# EAGLE design Laser_Array_Temp_Low_BRD_V2.1 (EAGLE 7.7.0)
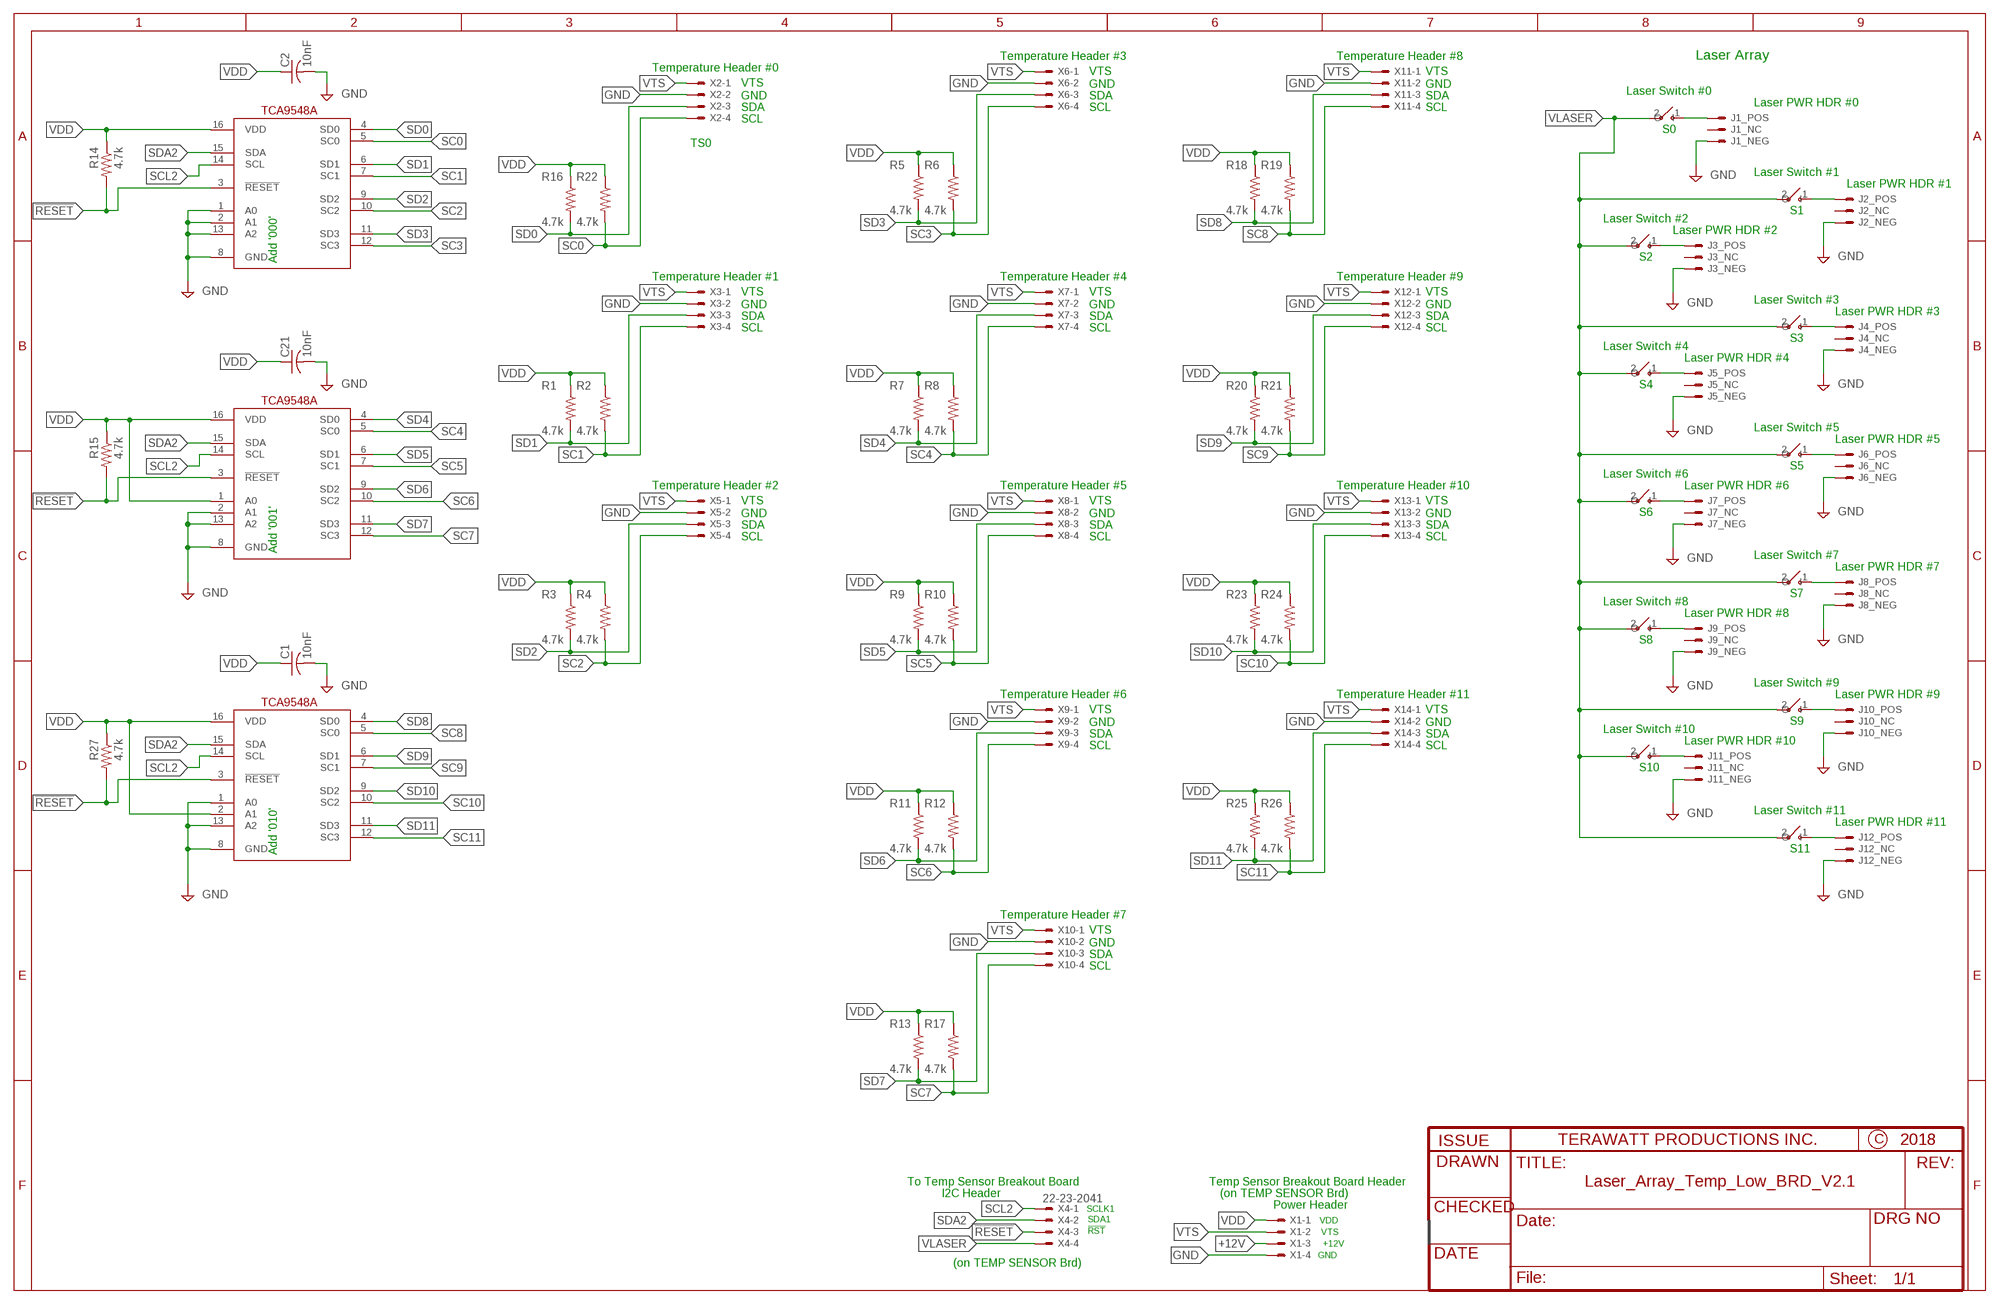
[diagram p0: schematic, sheet 1]

## Parts
C1  10nF  C-USC0805  [C0805]
C2  10nF  C-USC0805  [C0805]
C21  10nF  C-USC0805  [C0805]
J1  LASER_MOD  [LASER_MOD]
J2  LASER_MOD  [LASER_MOD]
J3  LASER_MOD  [LASER_MOD]
J4  LASER_MOD  [LASER_MOD]
J5  LASER_MOD  [LASER_MOD]
J6  LASER_MOD  [LASER_MOD]
J7  LASER_MOD  [LASER_MOD]
J8  LASER_MOD  [LASER_MOD]
J9  LASER_MOD  [LASER_MOD]
J10  LASER_MOD  [LASER_MOD]
J11  LASER_MOD  [LASER_MOD]
J12  LASER_MOD  [LASER_MOD]
R1  4.7k  R-US_M0805  [M0805]
R2  4.7k  R-US_M0805  [M0805]
R3  4.7k  R-US_M0805  [M0805]
R4  4.7k  R-US_M0805  [M0805]
R5  4.7k  R-US_M0805  [M0805]
R6  4.7k  R-US_M0805  [M0805]
R7  4.7k  R-US_M0805  [M0805]
R8  4.7k  R-US_M0805  [M0805]
R9  4.7k  R-US_M0805  [M0805]
R10  4.7k  R-US_M0805  [M0805]
R11  4.7k  R-US_M0805  [M0805]
R12  4.7k  R-US_M0805  [M0805]
R13  4.7k  R-US_M0805  [M0805]
R14  4.7k  R-US_M0805  [M0805]
R15  4.7k  R-US_M0805  [M0805]
R16  4.7k  R-US_M0805  [M0805]
R17  4.7k  R-US_M0805  [M0805]
R18  4.7k  R-US_M0805  [M0805]
R19  4.7k  R-US_M0805  [M0805]
R20  4.7k  R-US_M0805  [M0805]
R21  4.7k  R-US_M0805  [M0805]
R22  4.7k  R-US_M0805  [M0805]
R23  4.7k  R-US_M0805  [M0805]
R24  4.7k  R-US_M0805  [M0805]
R25  4.7k  R-US_M0805  [M0805]
R26  4.7k  R-US_M0805  [M0805]
R27  4.7k  R-US_M0805  [M0805]
S13  TOGGLE_SPST  [22-23-2021]
S14  TOGGLE_SPST  [22-23-2021]
S15  TOGGLE_SPST  [22-23-2021]
S16  TOGGLE_SPST  [22-23-2021]
S17  TOGGLE_SPST  [22-23-2021]
S18  TOGGLE_SPST  [22-23-2021]
S19  TOGGLE_SPST  [22-23-2021]
S20  TOGGLE_SPST  [22-23-2021]
S21  TOGGLE_SPST  [22-23-2021]
S22  TOGGLE_SPST  [22-23-2021]
S23  TOGGLE_SPST  [22-23-2021]
S24  TOGGLE_SPST  [22-23-2021]
U1  TCA9546A  [SOIC16N]
U2  TCA9546A  [SOIC16N]
U3  TCA9546A  [SOIC16N]
X1  22-23-2041  [22-23-2041]
X2  22-23-2041  [22-23-2041]
X3  22-23-2041  [22-23-2041]
X4  22-23-2041  [22-23-2041]
X5  22-23-2041  [22-23-2041]
X6  22-23-2041  [22-23-2041]
X7  22-23-2041  [22-23-2041]
X8  22-23-2041  [22-23-2041]
X9  22-23-2041  [22-23-2041]
X10  22-23-2041  [22-23-2041]
X11  22-23-2041  [22-23-2041]
X12  22-23-2041  [22-23-2041]
X13  22-23-2041  [22-23-2041]
X14  22-23-2041  [22-23-2041]

## Nets
!RESET: R14.2 R15.2 R27.2 U1.3(!RESET) U2.3(!RESET) U3.3(!RESET) X4.3
+12V: X1.3
GND: C1.2 C2.2 C21.2 J1.3 J2.3 J3.3 J4.3 J5.3 J6.3 J7.3 J8.3 J9.3 J10.3 J11.3 J12.3 U1.1(A0) U1.2(A1) U1.8(GND) U1.13(A2) U2.2(A1) U2.8(GND) U2.13(A2) U3.1(A0) U3.8(GND) U3.13(A2) X1.4 X2.2 X3.2 X5.2 X6.2 X7.2 X8.2 X9.2 X10.2 X11.2 X12.2 X13.2 X14.2
N$1: J2.1 S13.1(O)
N$2: J1.1 S16.1(O)
N$3: J3.1 S14.1(O)
N$4: J4.1 S15.1(O)
N$5: J5.1 S17.1(O)
N$6: J6.1 S18.1(O)
N$7: J7.1 S19.1(O)
N$8: J8.1 S20.1(O)
N$9: J9.1 S21.1(O)
N$10: J10.1 S22.1(O)
N$11: J11.1 S23.1(O)
N$12: J12.1 S24.1(O)
SC0: R22.2 U1.5(SC0) X2.4
SC1: R2.2 U1.7(SC1) X3.4
SC2: R4.2 U1.10(SC2) X5.4
SC3: R6.2 U1.12(SC3) X6.4
SC4: R8.2 U2.5(SC0) X7.4
SC5: R10.2 U2.7(SC1) X8.4
SC6: R12.2 U2.10(SC2) X9.4
SC7: R17.2 U2.12(SC3) X10.4
SC8: R19.2 U3.5(SC0) X11.4
SC9: R21.2 U3.7(SC1) X12.4
SC10: R24.2 U3.10(SC2) X13.4
SC11: R26.2 U3.12(SC3) X14.4
SCL2: U1.14(SCL) U2.14(SCL) U3.14(SCL) X4.1
SD0: R16.2 U1.4(SD0) X2.3
SD1: R1.2 U1.6(SD1) X3.3
SD2: R3.2 U1.9(SD2) X5.3
SD3: R5.2 U1.11(SD3) X6.3
SD4: R7.2 U2.4(SD0) X7.3
SD5: R9.2 U2.6(SD1) X8.3
SD6: R11.2 U2.9(SD2) X9.3
SD7: R13.2 U2.11(SD3) X10.3
SD8: R18.2 U3.4(SD0) X11.3
SD9: R20.2 U3.6(SD1) X12.3
SD10: R23.2 U3.9(SD2) X13.3
SD11: R25.2 U3.11(SD3) X14.3
SDA2: U1.15(SDA) U2.15(SDA) U3.15(SDA) X4.2
VDD: C1.1 C2.1 C21.1 R1.1 R2.1 R3.1 R4.1 R5.1 R6.1 R7.1 R8.1 R9.1 R10.1 R11.1 R12.1 R13.1 R14.1 R15.1 R16.1 R17.1 R18.1 R19.1 R20.1 R21.1 R22.1 R23.1 R24.1 R25.1 R26.1 R27.1 U1.16(VDD) U2.1(A0) U2.16(VDD) U3.2(A1) U3.16(VDD) X1.1
VLASER: S13.2(I) S14.2(I) S15.2(I) S16.2(I) S17.2(I) S18.2(I) S19.2(I) S20.2(I) S21.2(I) S22.2(I) S23.2(I) S24.2(I) X4.4
VTS: X1.2 X2.1 X3.1 X5.1 X6.1 X7.1 X8.1 X9.1 X10.1 X11.1 X12.1 X13.1 X14.1
Unconnected: J1.2 J2.2 J3.2 J4.2 J5.2 J6.2 J7.2 J8.2 J9.2 J10.2 J11.2 J12.2

## Notes on the sheet
- Temperature Header #3 | Temperature Header #8 | Laser Array
- Temperature Header #0
- VTS | VTS
- VTS | GND | GND
- Laser Switch #0
- GND | SDA | SDA
- Laser PWR HDR #0
- SDA | SCL | SCL
- SCL
- S0
- TS0
- Laser Switch #1
- Laser PWR HDR #1
- S1
- Laser Switch #2
- Laser PWR HDR #2
- Add '000' | S2
- Temperature Header #1 | Temperature Header #4 | Temperature Header #9
- VTS | VTS | VTS
- Laser Switch #3
- GND | GND | GND
- Laser PWR HDR #3
- SDA | SDA | SDA
- SCL | SCL | SCL
- S3
- Laser Switch #4
- Laser PWR HDR #4
- S4
- Laser Switch #5
- Laser PWR HDR #5
- S5
- Laser Switch #6
- Temperature Header #2 | Temperature Header #5 | Temperature Header #10 | Laser PWR HDR #6
- VTS | VTS | VTS
- GND | GND | GND | S6
- SDA | SDA | SDA
- SCL | SCL | SCL
- Add '001'
- Laser Switch #7
- Laser PWR HDR #7
- S7
- Laser Switch #8
- Laser PWR HDR #8
- S8
- Laser Switch #9
- Temperature Header #6 | Temperature Header #11 | Laser PWR HDR #9
- VTS | VTS
- GND | GND | S9
- Laser Switch #10
- SDA | SDA
- Laser PWR HDR #10
- SCL | SCL
- S10
- Laser Switch #11
- Laser PWR HDR #11
- Add '010' | S11
- Temperature Header #7
- VTS
- GND
- SDA
- SCL
- To Temp Sensor Breakout Board | Temp Sensor Breakout Board Header
- I2C Header | (on TEMP SENSOR Brd)
- Power Header
- SCLK1
- SDA1 | VDD
- !RST | VTS
- +12V
- GND
- (on TEMP SENSOR Brd)

## Library data of the parts
C1 C2 C21 = rcl:C-US: CAPACITOR, American symbol
J1-J12 = Mine:LASER_MOD
R1-R27 = rcl:R-US_: RESISTOR, American symbol
S13-S24 = Mine:TOGGLE_SPST: SPST Toggle SPST toggle switch with no package
U1-U3 = Mine:TCA9546A
X1-X14 = Mine:22-23-2041: .100" (2.54mm) Center Header - 4 Pin; MF: MOLEX; MPN: 22-23-2041; OC_FARNELL: 1462920; OC_NEWARK: 38C0355

## Net classes
0 default: width 0.254 mm, drill 0.508 mm, clearance 0.203 mm

## Board
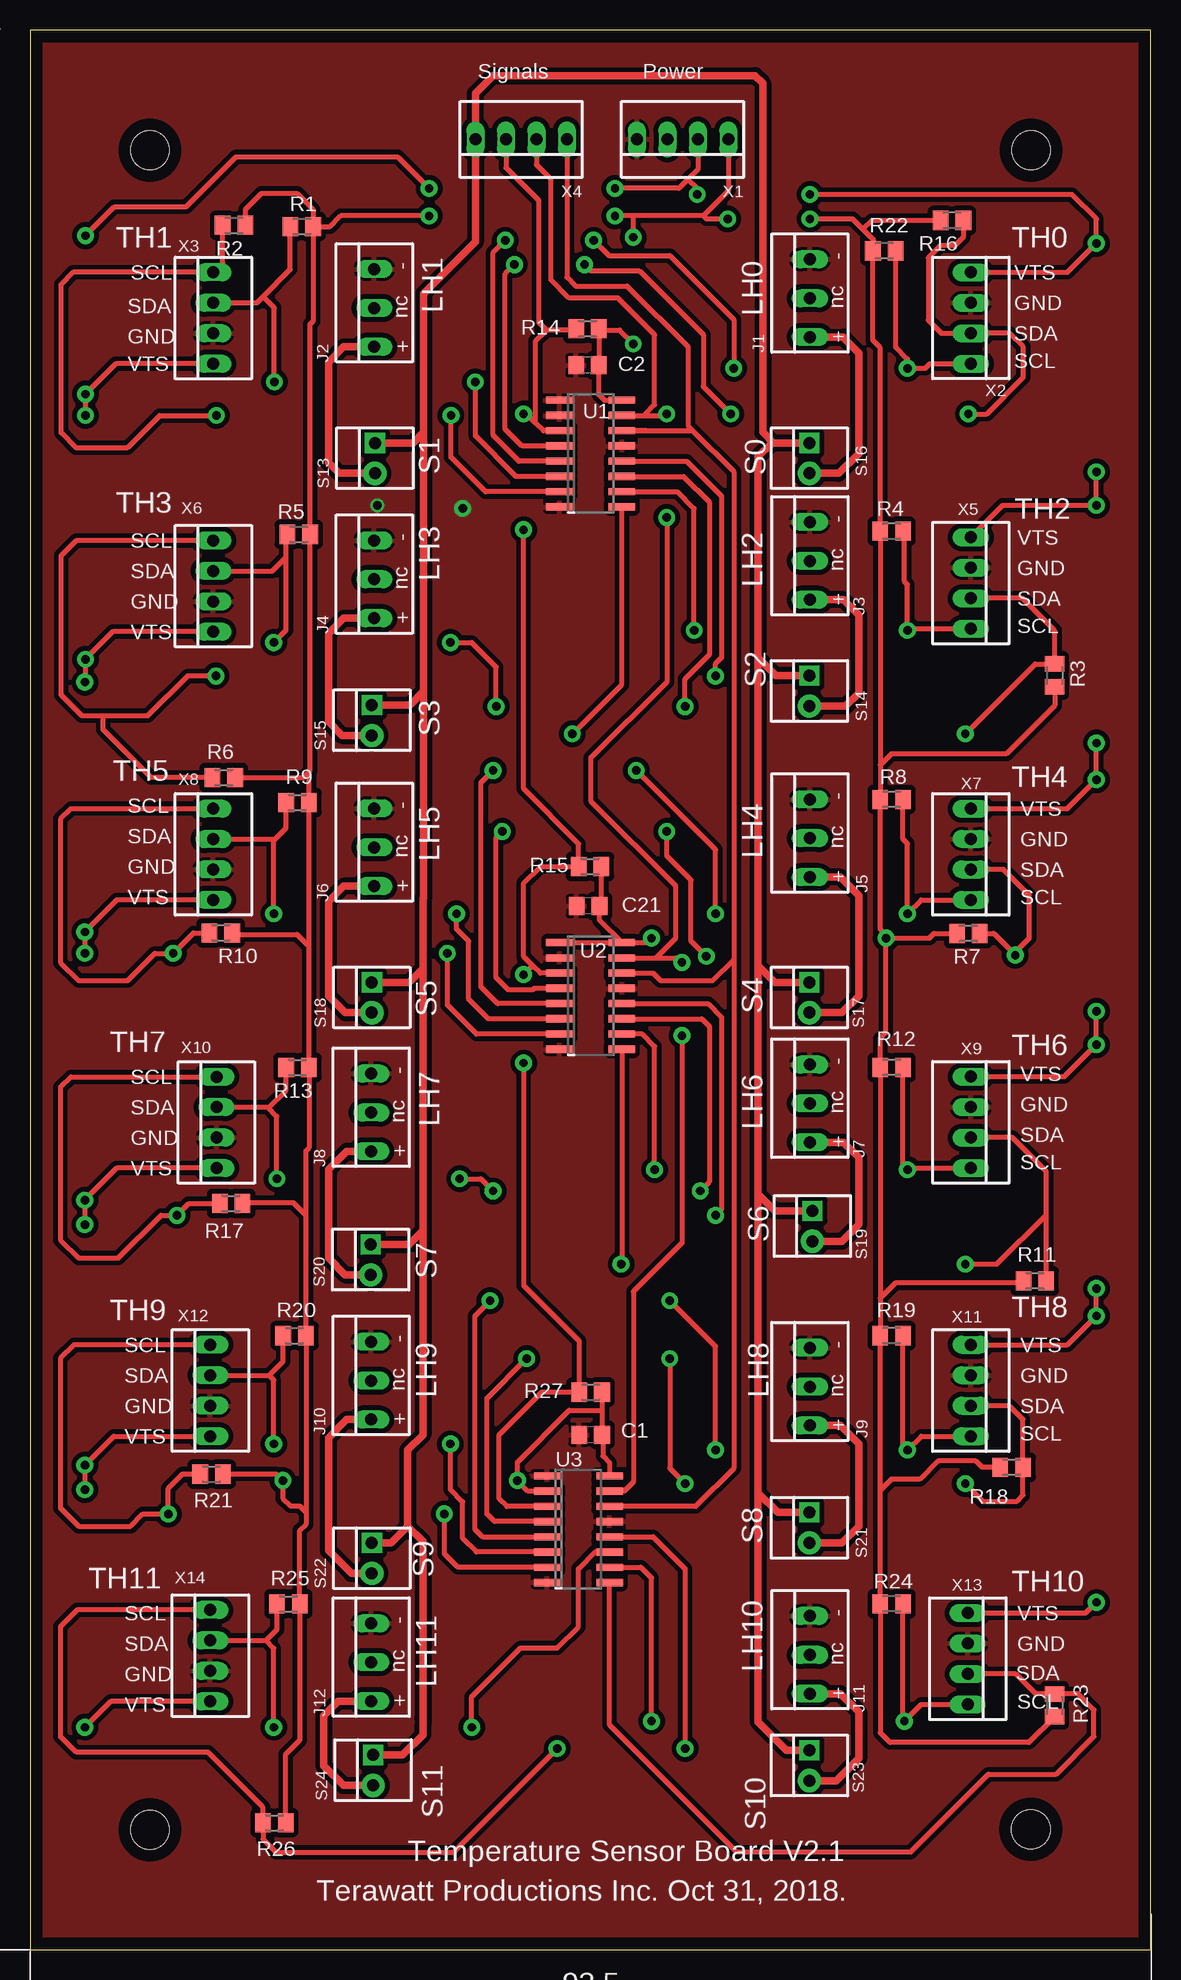
[diagram p1: board, top side]
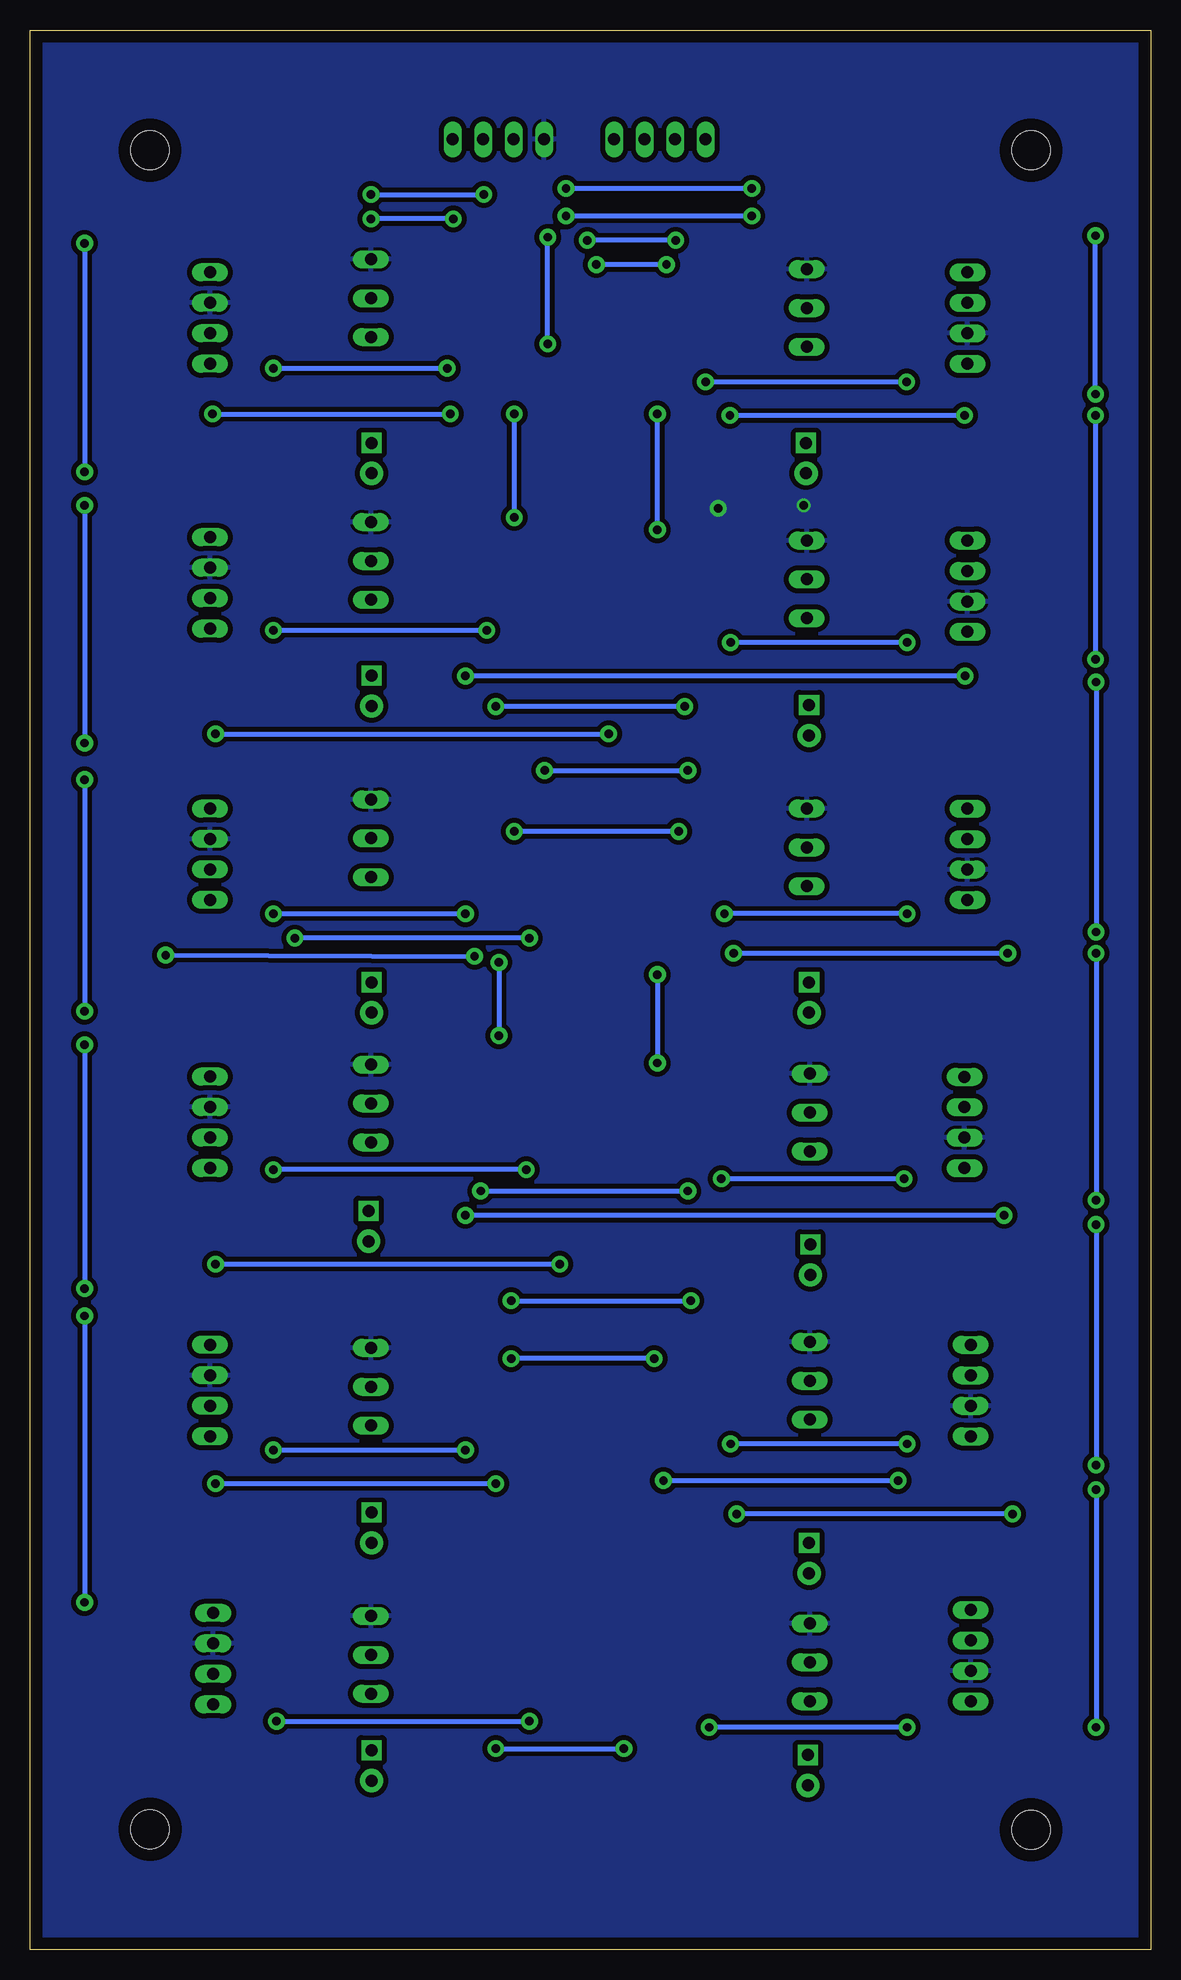
[diagram p2: board, bottom side, seen from below]

Size 93.45 x 160.02 mm. Coordinates in mm from the lower left corner, seen from the top.
Outline: 0,0 93.45,0 93.45,160.02 0,160.02 0,0
Copper layers (1*16): Top 0.035mm / dielectric 1.5mm / Bottom 0.035mm
Design rules "default *": minimum track width 10mil, minimum drill 24mil, track to track 16mil, track to pad 14mil, pad to pad 14mil, via to via 14mil, smd to smd 14mil, copper to edge 40mil, drill to drill 8mil, minimum pad ring 10mil, minimum via ring 8mil, stop-mask expansion 4mil, vias tented up to drill 0mil, thermal gap 10mil
Holes 3.2 mm at 10,10 10,150 83.44,10.04 83.46,150

### Footprints (pad centres in the part's own frame; a part is rotated, then mirrored left to right if it is on the bottom)
C0805 = smd 1.3 x 1.5: 1 -0.95,0; 2 0.95,0
LASER_MOD = drill 1 long: 1 -2.54,0; 2 0.7,0; 3 3.94,0
M0805 = smd 1.3 x 1.6: 1 -0.95,0; 2 0.95,0
22-23-2021 = drill 1 pad 1.93: 1 -1.27,0 | drill 1 pad 1.676 square: 2 1.27,0
SOIC16N = smd 0.6 x 2.2: 1 -4.445,-2.6; 2 -3.175,-2.6; 3 -1.905,-2.6; 4 -0.635,-2.6; 5 0.635,-2.6; 6 1.905,-2.6; 7 3.175,-2.6; 8 4.445,-2.6; 9 4.445,2.6; 10 3.175,2.6; 11 1.905,2.6; 12 0.635,2.6; 13 -0.635,2.6; 14 -1.905,2.6; 15 -3.175,2.6; 16 -4.445,2.6
22-23-2041 = drill 1 long: 1 -3.81,0; 2 -1.27,0; 3 1.27,0; 4 3.81,0

### Placement (x,y rotation side)
C1  46.74,42.93 180 top
C2  46.48,132.08 180 top
C21  46.53,86.99 180 top
J1  65.02,136.96 90 top
J2  28.7,136.14 90 top
J3  65.02,115.06 90 top
J4  28.7,113.54 90 top
J5  65.02,91.95 90 top
J6  28.7,91.19 90 top
J7  65.02,69.85 90 top
J8  28.45,69.09 90 top
J9  65.02,46.23 90 top
J10  28.45,46.74 90 top
J11  65.02,23.88 90 top
J12  28.45,23.27 90 top
R1  22.65,143.64 180 top
R2  17.02,143.74 180 top
R3  85.42,106.22 90 top
R4  71.83,118.24 0 top
R5  22.4,117.98 180 top
R6  16.15,97.71 180 top
R7  78.23,84.71 0 top
R8  71.83,95.89 0 top
R9  22.3,95.63 180 top
R10  15.9,84.76 180 top
R11  83.77,55.75 0 top
R12  71.83,73.53 0 top
R13  22.3,73.53 180 top
R14  46.48,135.13 180 top
R15  46.69,90.3 180 top
R16  76.86,144.15 0 top
R17  16.77,62.21 180 top
R18  81.84,40.21 0 top
R19  71.83,51.18 0 top
R20  22.05,51.18 180 top
R21  15.14,39.65 180 top
R22  71.22,141.6 0 top
R23  85.42,20.37 90 top
R24  71.83,28.83 0 top
R25  21.54,28.83 180 top
R26  20.37,10.59 180 top
R27  46.74,46.48 180 top
S13  28.75,124.33 90 top
S14  64.97,104.93 90 top
S15  28.5,102.49 90 top
S16  64.97,124.33 90 top
S17  64.97,79.38 90 top
S18  28.5,79.37 90 top
S19  65.23,60.33 90 top
S20  28.4,57.53 90 top
S21  64.97,35.18 90 top
S22  28.5,32.64 90 top
S23  64.97,15.37 90 top
S24  28.6,14.96 90 top
U1  46.74,124.71 270 top
U2  46.74,79.5 270 top
U3  45.72,35.05 270 top
X1  54.41,150.9 180 top
X2  78.44,136.02 270 top
X3  15.29,136.02 90 top
X4  40.94,150.9 180 top
X5  78.44,113.92 270 top
X6  15.29,113.66 90 top
X7  78.44,91.31 270 top
X8  15.29,91.31 90 top
X9  78.44,68.96 270 top
X10  15.54,68.96 90 top
X11  78.44,46.61 270 top
X12  15.03,46.61 90 top
X13  78.18,24.26 270 top
X14  15.03,24.51 90 top

### Tracks (layer width: path | path; a pad name or v marks a point on that pad's centre or on a via)
!RESET  (via drill 0.7 pad 1.4)
  Top 0.406: U1.3 42.8,126.62 42.16,127.25 | 42.16,127.25 42.16,134.11 43.05,135 | R14.2 45.41,135 43.05,135 | 42.16,127.25 41.4,128.02 v41.15,128.02 | 43.05,135 42.42,135.64 42.42,145.8 39.67,148.54 X4.3 | U2.3 42.55,81.41 42.04,81.92 | 42.04,81.92 41.15,82.8 41.15,88.9 42.55,90.3 R15.2 45.74,92.18 41.15,96.77 v41.15,118.36 | v41.15,73.91 41.15,55.37 45.79,50.73 R27.2 42.67,46.48 39.12,42.93 39.12,37.59 39.75,36.96 U3.3 | v41.15,81.28 41.78,81.92 42.04,81.92
  Bottom 0.406: v41.15,118.36 v41.15,128.02 | v41.15,81.28 v41.15,73.91
GND  (via drill 0.7, 0.7 pad 1.4)
  other vias: 28.96,120.4 36.07,120.14
  pour Top: 0,160.1 93.47,159.84 93.47,-0.25 0,0
  pour Bottom: 0,160.1 94.23,159.84 94.23,-0.25 0.25,0
N$1
  Top 0.61: S13.1 25.78,123.06 24.89,123.95 24.89,132.33 26.16,133.6 J2.1
N$2
  Top 0.61: S16.1 67.44,123.06 69.09,124.71 69.09,133.1 67.82,134.37 67.82,134.42 J1.1
N$3
  Top 0.61: J3.1 67.82,112.52 69.09,111.25 69.09,104.75 68,103.66 S14.1
N$4
  Top 0.61: S15.1 26.04,101.22 24.89,102.36 24.89,109.73 26.16,111 J4.1
N$5
  Top 0.61: S17.1 67.69,78.11 69.09,79.5 69.09,87.88 67.56,89.41 J5.1
N$6
  Top 0.61: S18.1 26.29,78.1 24.89,79.5 24.89,87.38 26.16,88.65 J6.1
N$7
  Top 0.61: S19.1 67.69,59.05 69.09,60.45 69.09,66.04 67.82,67.31 J7.1
N$8
  Top 0.61: S20.1 26.29,56.26 24.89,57.66 24.89,65.02 26.42,66.55 J8.1
N$9
  Top 0.61: S21.1 67.69,33.91 69.09,35.31 69.09,42.16 67.56,43.69 J9.1
N$10
  Top 0.61: S22.1 26.8,31.37 24.89,33.27 24.89,42.67 26.42,44.2 J10.1
N$11
  Top 0.61: J11.1 67.56,21.34 69.09,19.81 69.09,15.95 67.23,14.1 S23.1
N$12
  Top 0.61: J12.1 25.7,20.73 24.49,19.51 24.49,15.34 26.14,13.69 S24.1
SC0  (via drill 0.7 pad 1.4)
  Top 0.406: U1.5 40.77,124.08 38.61,126.24 38.61,141.48 v39.62,142.49 | v46.99,142.49 48.26,141.22 53.34,141.22 58.67,135.89 v58.67,131.83 | R22.2 72.17,133.57 73.15,132.59 v73.15,131.83 74.62,131.83 75.01,132.21 X2.4
  Bottom 0.406: v73.15,131.83 v58.67,131.83 | v39.62,142.49 v46.99,142.49
SC1  (via drill 0.7 pad 1.4)
  Top 0.406: U1.7 37.97,121.54 35.1,124.41 v35.1,127.89 | v15.54,127.89 10.79,127.89 8.13,125.22 3.81,125.22 2.59,126.44 2.59,138.81 3.6,139.83 X3.4 16.07,140.6 R2.2
  Bottom 0.406: v15.54,127.89 v35.1,127.89
SC2  (via drill 0.7 pad 1.4)
  Top 0.406: U1.10 53.98,121.54 55.37,120.14 v55.37,109.98 | R4.2 72.9,118.12 72.9,114.05 73.15,113.79 v73.15,109.98 73.28,110.11 X5.4
  Bottom 0.406: v73.15,109.98 v55.37,109.98
SC3  (via drill 0.7 pad 1.4)
  Top 0.406: U1.12 54.74,124.08 57.66,121.16 57.66,107.7 57.15,107.19 v57.15,106.17 | X6.4 3.86,117.47 2.59,116.2 2.59,104.6 4.32,102.87 6.1,102.87 | v15.49,106.17 13.13,106.17 9.83,102.87 6.1,102.87 | R6.2 10.09,97.71 6.1,101.7 6.1,102.87
  Bottom 0.406: v15.49,106.17 v57.15,106.17
SC4  (via drill 0.7 pad 1.4)
  Top 0.406: U2.5 38.99,78.87 37.59,80.26 37.59,97.28 v38.61,98.3 | 50.55,98.04 v50.55,98.3 57.15,91.69 v57.15,86.36 | R8.2 72.78,92.57 73.15,92.2 v73.15,86.36 74.3,87.5 X7.4
  Bottom 0.406: v73.15,86.36 v57.15,86.36 | v50.55,98.3 v38.61,98.3
SC5  (via drill 0.7 pad 1.4)
  Top 0.406: U2.7 37.21,76.33 34.8,78.74 v34.8,83.06 | X8.4 3.43,95.12 2.54,94.23 2.54,82.3 4.06,80.77 8.13,80.77 10.41,83.06 v11.94,83.06 13.64,84.76 R10.2
  Bottom 0.406: v11.94,83.06 v34.8,83.06
SC6  (via drill 0.7 pad 1.4)
  Top 0.406: U2.10 51.05,76.33 52.07,75.31 v52.07,65.02 | R12.2 72.78,65.39 v73.15,65.02 73.28,65.15 X9.4
  Bottom 0.406: v52.07,65.02 v73.15,65.02
SC7  (via drill 0.7 pad 1.4)
  Top 0.406: U2.12 56.52,78.87 57.66,77.72 57.66,61.72 v57.15,61.21 | X10.4 3.43,72.77 2.54,71.88 2.54,59.18 4.06,57.66 7.37,57.66 10.92,61.21 v12.24,61.21 13.23,62.21 R17.2
  Bottom 0.406: v12.24,61.21 v57.15,61.21
SC8  (via drill 0.7 pad 1.4)
  Top 0.406: v53.34,54.1 57.15,50.29 v57.15,41.66 | U3.5 37.72,34.42 37.08,35.05 37.08,52.83 v38.35,54.1 | R19.2 72.78,42.03 v73.15,41.66 74.3,42.8 X11.4
  Bottom 0.406: v73.15,41.66 v57.15,41.66 | v53.34,54.1 v38.35,54.1
SC9  (via drill 0.7 pad 1.4)
  Top 0.406: U3.7 35.69,31.88 34.54,33.02 v34.54,36.32 | X12.4 3.68,50.42 2.54,49.28 2.54,36.83 4.06,35.31 8.38,35.31 9.4,36.32 v11.53,36.32 11.53,38.46 12.73,39.65 R21.2
  Bottom 0.406: v11.53,36.32 v34.54,36.32
SC10  (via drill 0.7 pad 1.4)
  Top 0.406: U3.10 50.93,31.88 51.82,30.99 v51.82,19.05 | R24.2 72.78,19.17 v72.9,19.05 74.3,20.45 X13.4
  Bottom 0.406: v72.9,19.05 v51.82,19.05
SC11  (via drill 0.7 pad 1.4)
  Top 0.406: U3.12 51.94,34.42 54.61,31.75 v54.61,16.76 | v43.94,16.76 35.31,8.13 20.52,8.13 19.42,9.23 R26.2 19.42,11.87 14.83,16.46 8.03,16.46 6.3,16.46 3.86,16.46 2.54,17.78 2.54,26.92 3.94,28.32 X14.4
  Bottom 0.406: v54.61,16.76 v43.94,16.76
SCL2
  Top 0.406: 51.44,126.62 U1.14 55.24,126.62 | 55.24,126.62 58.67,123.19 58.67,82.55 | U2.14 51.94,81.41 52.58,80.77 56.9,80.77 58.67,82.55 | 58.67,82.55 58.67,40.13 55.5,36.96 U3.14 | 55.24,126.62 54.86,127 54.86,133.6 49.78,138.68 45.47,138.68 44.76,139.4 X4.1
SD0  (via drill 0.7 pad 1.4)
  Top 0.406: U1.4 41.02,125.35 39.62,126.75 39.62,139.7 v40.39,140.46 | v58.42,128.02 56.13,130.3 56.13,134.62 50.8,139.95 46.74,139.95 v46.23,140.46 | v78.23,128.02 79.76,128.02 82.8,131.06 82.8,133.6 81.66,134.75 78.94,134.75 X2.3 75.97,134.75 74.88,135.84 74.88,141.02 75.89,142.04 77.11,142.04 77.81,142.73 R16.2
  Bottom 0.406: v78.23,128.02 v58.42,128.02 | v40.39,140.46 v46.23,140.46
SD1  (via drill 0.7 pad 1.4)
  Top 0.406: U1.6 40.51,122.81 37.13,126.19 v37.13,130.68 | X3.3 18.92,137.29 19.43,137.79 | 19.43,137.79 21.7,140.07 R1.2 | v20.37,130.68 20.37,136.86 19.43,137.79
  Bottom 0.406: v20.37,130.68 v37.13,130.68
SD2  (via drill 0.7 pad 1.4)
  Top 0.406: U1.9 49.34,105.47 v45.21,101.35 | X5.3 82.73,112.65 85.42,109.96 R3.2 83.81,107.17 v77.98,101.35
  Bottom 0.406: v77.98,101.35 v45.21,101.35
SD3  (via drill 0.7 pad 1.4)
  Top 0.406: U1.11 54.48,122.81 56.64,120.65 56.64,107.95 54.61,105.92 v54.61,103.63 | v38.86,103.63 38.86,106.93 36.83,108.97 v35.05,108.97 | X6.3 20.19,114.93 21.34,116.08 | 21.34,116.08 21.34,117.87 R5.2 | v20.32,108.97 21.34,109.98 21.34,116.08
  Bottom 0.406: v20.32,108.97 v35.05,108.97 | v38.86,103.63 v54.61,103.63
SD4  (via drill 0.7 pad 1.4)
  Top 0.406: U2.4 42.04,80.14 41.91,80.01 39.88,80.01 38.86,81.03 38.86,92.71 v39.37,93.22 | v56.39,82.8 55.12,84.07 55.12,89.15 53.09,91.19 v53.09,93.22 | X7.3 81.15,90.04 83.31,87.88 83.31,84.33 82.14,83.16 v82.14,82.91 80.34,84.71 R7.2
  Bottom 0.406: v82.14,82.91 v56.39,82.8 | v39.37,93.22 v53.09,93.22
SD5  (via drill 0.7 pad 1.4)
  Top 0.406: U2.6 38.23,77.6 36.58,79.25 36.58,84.07 35.56,85.09 v35.56,86.36 | X8.3 20.32,92.58 | 20.32,92.58 20.45,92.58 21.35,93.49 R9.2 | v20.32,86.36 20.32,92.58
  Bottom 0.406: v20.32,86.36 v35.56,86.36
SD6  (via drill 0.7 pad 1.4)
  Top 0.406: U2.9 49.34,57.21 v49.28,57.15 | X9.3 81.92,67.69 84.72,64.89 84.72,61.57 84.72,61.25 | R11.2 84.72,61.25 | v77.98,57.15 80.62,57.15 84.72,61.25
  Bottom 0.406: v77.98,57.15 v49.28,57.15
SD7  (via drill 0.7 pad 1.4)
  Top 0.406: U2.11 56.01,77.6 56.64,76.96 56.64,64.01 v55.88,63.25 | v35.81,64.26 37.59,64.26 v38.61,63.25 | X10.3 19.81,70.23 | 19.81,70.23 19.94,70.23 21.34,71.63 21.34,73.52 R13.2 | v20.57,64.26 20.57,69.47 19.81,70.23
  Bottom 0.406: v20.57,64.26 v35.81,64.26 | v55.88,63.25 v38.61,63.25
SD8  (via drill 0.7 pad 1.4)
  Top 0.406: U3.4 38.73,35.69 38.1,36.32 38.1,45.97 v41.4,49.28 | v53.34,49.28 53.34,40.13 v54.61,38.86 | X11.3 81.66,45.34 82.79,44.21 R18.2 82.79,37.88 82.3,37.39 79.45,37.39 v77.98,38.86
  Bottom 0.406: v77.98,38.86 v54.61,38.86 | v41.4,49.28 v53.34,49.28
SD9  (via drill 0.7 pad 1.4)
  Top 0.406: U3.6 37.21,33.15 36.07,34.29 36.07,37.34 35.05,38.35 v35.05,42.16 | X12.3 19.94,47.88 | 19.94,47.88 21.1,49.04 R20.2 | v20.32,42.16 20.32,47.5 19.94,47.88
  Bottom 0.406: v20.32,42.16 v35.05,42.16
SD10
  Top 0.406: U3.9 48.32,18.74 58.93,8.13 73.41,8.13 79.91,14.63 85.55,14.63 88.7,17.78 88.7,20.02 87.38,21.34 85.44,21.34 R23.2 83.83,21.32 82.17,22.99 X13.3
SD11  (via drill 0.7 pad 1.4)
  Top 0.406: U3.11 47.12,33.15 45.72,31.75 45.72,26.92 43.94,25.15 40.89,25.15 36.83,21.08 v36.83,18.54 | X14.3 19.68,25.78 | 19.68,25.78 20.59,26.69 R25.2 | v20.32,18.54 20.32,25.14 19.68,25.78
  Bottom 0.406: v20.32,18.54 v36.83,18.54
SDA2  (via drill 0.7 pad 1.4)
  Top 0.406: U3.15 49.53,38.23 50.29,38.99 50.29,54.86 54.36,58.93 v54.36,76.2 | v53.09,128.02 52.96,127.89 U1.15 51.18,127.89 52.07,128.78 52.07,134.62 49.02,137.67 44.96,137.67 43.43,139.19 43.43,147.57 42.22,148.79 X4.2 | v53.09,119.38 53.09,105.66 46.74,99.31 46.74,95.76 53.85,88.65 53.85,84.33 52.2,82.68 U2.15 53.98,82.68 v54.36,82.3
  Bottom 0.406: v53.09,128.02 v53.09,119.38 | v54.36,82.3 v54.36,76.2
VDD  (via drill 0.7 pad 1.4)
  Top 0.406: U1.16 47.88,129.16 47.43,129.61 C2.1 R14.1 47.56,135 49.15,135 v50.29,133.86 | 50.29,144.53 v48.77,144.53 | v33.27,144.53 25.91,144.53 25.02,143.64 R1.1 | v50.29,142.75 50.29,144.53 | 71.37,84.58 v71.37,84.33 71.37,76.45 70.88,75.96 R12.1 70.88,54.32 | 56.13,144.53 50.29,144.53 | 56.13,144.53 58.22,146.61 X1.1 | 56.13,144.53 56.39,144.27 v58.17,144.27 | U2.1 U2.16 | U2.16 47.48,85.8 C21.1 47.64,87.15 R15.1 | R27.1 47.69,44.96 | 47.69,44.96 C1.1 47.75,42.86 47.75,41.15 48.32,40.58 U3.16 | U3.2 41.53,38.23 v40.64,39.12 40.64,40.64 44.96,44.96 47.69,44.96 | U2.16 51.44,83.95 v51.82,84.33 | 71.37,84.58 71.63,84.33 74.98,84.33 75.36,84.71 R7.1 | 23.25,98.16 R9.1 23.25,83.63 | 23,36.47 R20.1 23,61.23 | 23,36.47 23,35.45 22.49,34.94 R25.1 22.49,17.48 21.32,16.31 R26.1 | 70.88,98.75 R4.1 70.88,133.54 70.27,134.15 R22.1 70.31,141.64 70.31,142.54 69.44,143.41 | 70.88,98.75 R8.1 70.88,85.08 71.37,84.58 | 70.88,54.32 R19.1 70.88,38.3 | 70.88,38.3 R24.1 70.88,18.09 71.69,17.27 83.27,17.27 R23.1 | R1.1 23.6,135.74 23.35,135.48 R5.1 23.35,98.25 23.25,98.16 | v65.02,144.27 68.58,144.27 69.44,143.41 | R16.1 70.18,144.15 69.44,143.41 | R3.1 85.42,103.71 81.38,99.67 71.8,99.67 70.88,98.75 | R11.1 82.64,55.58 72.14,55.58 70.88,54.32 | R18.1 79.38,40.21 78.84,40.74 75.69,40.74 74.17,39.22 71.8,39.22 70.88,38.3 | R2.1 17.96,145.07 19.3,146.41 22.25,146.41 23.6,145.05 R1.1 | R6.1 22.81,97.71 23.25,98.16 | 23.25,83.63 R13.1 23.25,66.85 23,66.6 23,61.23 | R10.1 16.98,84.63 22.25,84.63 23.25,83.63 | R17.1 17.79,62.28 21.95,62.28 23,61.23 | R21.1 20.55,39.65 v21.08,39.12 21.08,37.64 21.74,36.98 22.49,36.98 23,36.47
  Bottom 0.406: v48.77,144.53 v33.27,144.53 | v50.29,133.86 v50.29,142.75 | v58.17,144.27 v65.02,144.27 | v51.82,84.33 v71.37,84.33 | v40.64,39.12 v21.08,39.12
VLASER
  Top 0.61: 32.81,126.49 32.81,138.05 37.13,142.37 X4.4 37.13,154.74 38.61,156.21 60.45,156.21 61.09,155.57 61.09,126.49 61.98,125.6 | 32.81,126.49 32.81,104.9 | 32.81,104.9 32.81,87.68 32.77,87.63 32.77,81.79 | 32.77,81.79 32.77,59.94 | 32.77,59.94 32.77,42.93 31.5,41.66 31.5,35.31 | 60.71,107.7 60.71,124.46 61.85,125.6 61.98,125.6 | 60.71,107.7 60.71,82.04 | 60.71,82.04 60.71,62.99 | 60.71,62.99 60.71,38.1 | 60.71,38.1 60.71,19 63.07,16.64 S23.2 | S16.2 61.98,125.6 | S13.2 31.92,125.6 32.81,126.49 | S15.2 31.67,103.76 32.81,104.9 | S18.2 31.62,80.64 32.77,81.79 | S17.2 62.1,80.64 60.71,82.04 | S19.2 62.1,61.59 60.71,62.99 | S21.2 62.36,36.45 60.71,38.1 | 31.5,35.31 32.77,34.04 32.77,19.3 32.77,18.69 32.77,17.93 31.06,16.23 S24.2 | 31.5,35.31 30.1,33.91 S22.2 | S20.2 31.62,58.8 32.77,59.94 | S14.2 62.2,106.2 60.71,107.7
VTS  (via drill 0.7 pad 1.4)
  Top 0.406: v4.62,142.87 7.03,145.29 13.01,145.29 17.17,149.45 30.63,149.45 v33.27,146.81 | 54.86,147.57 54.1,146.81 v48.77,146.81 | X12.1 6.98,42.8 v4.57,40.39 v4.57,38.35 | 54.86,147.57 55.63,146.81 v55.63,146.3 | v65.02,146.3 86.87,146.3 88.9,144.27 v88.9,142.24 86.49,139.83 X2.1 | X6.1 6.91,109.85 v4.62,107.57 4.62,105.71 v4.57,105.66 | v4.62,127.89 v4.62,129.67 7.16,132.21 X3.1 | X8.1 7.24,87.5 v4.57,84.84 v4.57,83.06 | X10.1 7.24,65.15 v4.57,62.48 v4.57,60.45 | X14.1 6.73,20.7 v4.57,18.54 | X5.1 81.1,120.4 v88.9,120.4 v88.9,123.19 | X7.1 86.49,95.12 v88.9,97.54 v88.9,100.58 | X9.1 86.23,72.77 v88.9,75.44 v88.9,78.23 | X11.1 86.49,50.42 v88.9,52.83 v88.9,55.12 | X13.1 88.01,28.07 v88.9,28.96 | X1.2 55.68,148.39 54.86,147.57
  Bottom 0.406: v4.62,127.89 v4.62,107.57 | v4.62,129.67 v4.62,142.87 | v4.57,105.66 v4.57,84.84 | v4.57,83.06 v4.57,62.48 | v48.77,146.81 v33.27,146.81 | v4.57,60.45 v4.57,40.39 | v4.57,38.35 v4.57,18.54 | v88.9,142.24 v88.9,123.19 | v88.9,120.4 v88.9,100.58 | v88.9,97.54 v88.9,78.23 | v88.9,75.44 v88.9,55.12 | v88.9,52.83 v88.9,28.96 | v65.02,146.3 v55.63,146.3

### Text on the board
tPlace: Signals | Power | TH1 | TH0 | SCL | VTS | GND | SDA | LH1 | LH0 | GND | SDA | VTS | SCL | S0 | S1 | TH3 | TH2 | SCL | VTS | GND | SDA | LH3 | LH2 | GND | SDA | SCL | VTS | S2 | S3 | TH5 | TH4 | SCL | VTS | SDA | GND | LH5 | LH4 | GND | SDA | VTS | SCL | S5 | S4 | TH7 | TH6 | SCL | VTS | SDA | GND | LH7 | LH6 | GND | SDA | VTS | SCL | S6 | S7 | TH8 | TH9 | SCL | VTS | SDA | GND | LH9 | LH8 | GND | SDA | VTS | SCL | S8 | S9 | TH11 | TH10 | SCL | VTS | SDA | GND | LH10 | GND | LH11 | SDA | VTS | SCL | S11 | S10 | Temperature Sensor Board V2.1 | Terawatt Productions Inc. Oct 31, 2018.